# Altium project motor_contorl_board.PrjPcb
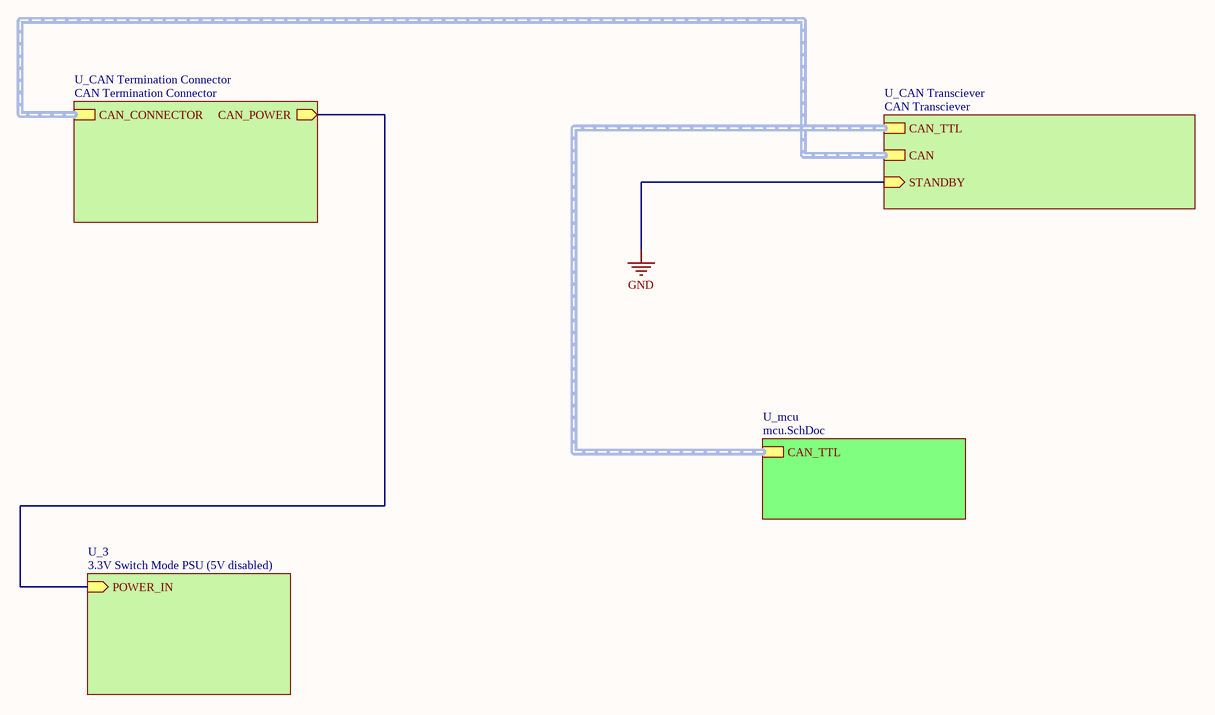
[diagram p0: toplevel.SchDoc]
3 sheets, 28 parts. Net scope: hierarchical (ports join the sheet entries above them; power ports are global).
Sheets:
  toplevel.SchDoc
    U_mcu = mcu.SchDoc
      U_pwmdisplay = pwmdisplay.SchDoc

## Sheet toplevel.SchDoc
size A4

### Sub-sheets
U_3 = 3.3V Switch Mode PSU (5V disabled) (file not in this document): POWER_IN (in)
U_CAN Termination Connector = CAN Termination Connector (file not in this document): CAN_CONNECTOR (harness CAN), CAN_POWER (out)
U_CAN Transciever = CAN Transciever (file not in this document): CAN_TTL (harness CAN_TTL), CAN (harness CAN), STANDBY (in)
U_mcu = mcu.SchDoc: CAN_TTL (harness CAN_TTL)

### Nets
(unnamed): sheet U_CAN Termination Connector/CAN_POWER, sheet U_3/POWER_IN

### Buses and harness runs
harness sheet U_CAN Termination Connector/CAN_CONNECTOR = sheet U_CAN Transciever/CAN
harness sheet U_CAN Transciever/CAN_TTL = sheet U_mcu/CAN_TTL

## Sheet mcu.SchDoc
size A4
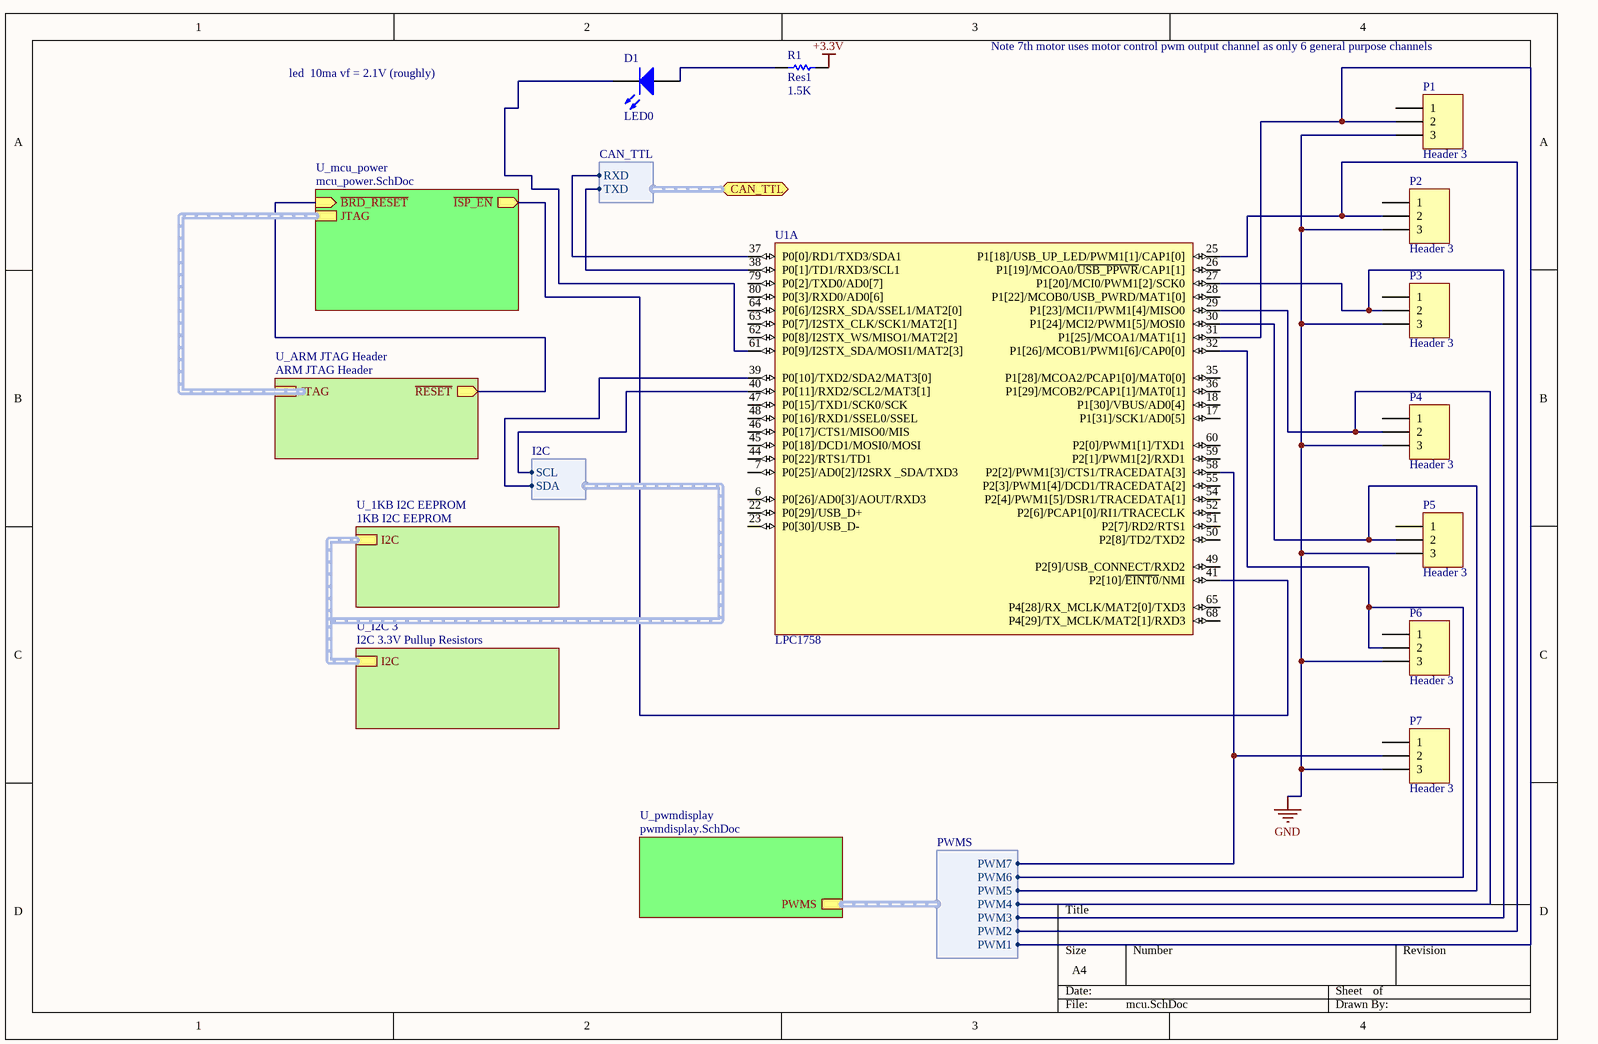
[diagram p1: mcu.SchDoc]

### Parts
D1  LED0  [LGQ971]
P1  Header 3  [HDR1X3]
P2  Header 3  [HDR1X3]
P3  Header 3  [HDR1X3]
P4  Header 3  [HDR1X3]
P5  Header 3  [HDR1X3]
P6  Header 3  [HDR1X3]
P7  Header 3  [HDR1X3]
R1  Res1  value 1.5K  [AXIAL-0.3]
U1  LPC1758  [LPC1758FBD80]  (part A of 3)

### Sub-sheets
U_1KB I2C EEPROM = 1KB I2C EEPROM (file not in this document): I2C (harness I2C)
U_ARM JTAG Header = ARM JTAG Header (file not in this document): JTAG (harness ARM_JTAG), ~{RESET} (out)
U_I2C 3 = I2C 3.3V Pullup Resistors (file not in this document): I2C (harness I2C)
U_mcu_power = mcu_power.SchDoc (file not in this document): ~{ISP_EN} (out), ~{BRD_RESET} (in), JTAG (harness ARM_JTAG)
U_pwmdisplay = pwmdisplay.SchDoc: PWMS (harness PWMS)

### Ports
CAN_TTL (harness CAN_TTL)

### Harnesses
CAN_TTL: RXD, TXD
I2C: SCL, SDA
PWMS: PWM1, PWM2, PWM3, PWM4, PWM5, PWM6, PWM7

### Nets
+3.3V: R1.2
GND: P1.3 P2.3 P3.3 P4.3 P5.3 P6.3 P7.3
Net*_2: P5.2 U1.30(P1[24]/MCI2/PWM1[5]/MOSI0) ; sheet U_pwmdisplay/PWMS.PWM5
Net*_4: P6.2 U1.32(P1[26]/MCOB1/PWM1[6]/CAP0[0]) ; sheet U_pwmdisplay/PWMS.PWM6
Net*_6: P7.2 U1.58(P2[2]/PWM1[3]/CTS1/TRACEDATA[3]) ; sheet U_pwmdisplay/PWMS.PWM7
Net*_11: P1.2 U1.31(P1[25]/MCOA1/MAT1[1]) ; sheet U_pwmdisplay/PWMS.PWM1
Net*_13: P2.2 U1.25(P1[18]/USB_UP_LED/PWM1[1]/CAP1[0]) ; sheet U_pwmdisplay/PWMS.PWM2
Net*_15: P3.2 U1.27(P1[20]/MCI0/PWM1[2]/SCK0) ; sheet U_pwmdisplay/PWMS.PWM3
Net*_17: P4.2 U1.29(P1[23]/MCI1/PWM1[4]/MISO0) ; sheet U_pwmdisplay/PWMS.PWM4
NetD1_1: D1.1(A) R1.1
NetD1_2: D1.2(K) U1.61(P0[9]/I2STX_SDA/MOSI1/MAT2[3])
NetU1_37: U1.37(P0[0]/RD1/TXD3/SDA1) ; port CAN_TTL.RXD
NetU1_38: U1.38(P0[1]/TD1/RXD3/SCL1) ; port CAN_TTL.TXD
NetU1_39: U1.39(P0[10]/TXD2/SDA2/MAT3[0]) ; sheet U_I2C 3/I2C.SDA
NetU1_40: U1.40(P0[11]/RXD2/SCL2/MAT3[1]) ; sheet U_I2C 3/I2C.SCL
NetU1_41: U1.41(P2[10]/~{EINT0}/NMI) ; sheet U_mcu_power/~{ISP_EN}
(unnamed): sheet U_mcu_power/~{BRD_RESET}, sheet U_ARM JTAG Header/~{RESET}

Not connected (* = marked no-connect by the designer): P1 1; P2 1; P3 1; P4 1; P5 1; P6 1; P7 1; U1 6(P0[26]/AD0[3]/AOUT/RXD3) 7(P0[25]/AD0[2]/I2SRX__SDA/TXD3) 17(P1[31]/SCK1/AD0[5]) 18(P1[30]/VBUS/AD0[4]) 22(P0[29]/USB_D+) 23(P0[30]/USB_D-) 26(P1[19]/MCOA0/~{USB_PPWR}/CAP1[1]) 28(P1[22]/MCOB0/USB_PWRD/MAT1[0]) 35(P1[28]/MCOA2/PCAP1[0]/MAT0[0]) 36(P1[29]/MCOB2/PCAP1[1]/MAT0[1]) 44(P0[22]/RTS1/TD1) 45(P0[18]/DCD1/MOSI0/MOSI) 46(P0[17]/CTS1/MISO0/MIS) 47(P0[15]/TXD1/SCK0/SCK) 48(P0[16]/RXD1/SSEL0/SSEL) 49(P2[9]/USB_CONNECT/RXD2) 50(P2[8]/TD2/TXD2) 51(P2[7]/RD2/RTS1) 52(P2[6]/PCAP1[0]/RI1/TRACECLK) 54(P2[4]/PWM1[5]/DSR1/TRACEDATA[1]) 55(P2[3]/PWM1[4]/DCD1/TRACEDATA[2]) 59(P2[1]/PWM1[2]/RXD1) 60(P2[0]/PWM1[1]/TXD1) 62(P0[8]/I2STX_WS/MISO1/MAT2[2]) 63(P0[7]/I2STX_CLK/SCK1/MAT2[1]) 64(P0[6]/I2SRX_SDA/SSEL1/MAT2[0]) 65(P4[28]/RX_MCLK/MAT2[0]/TXD3) 68(P4[29]/TX_MCLK/MAT2[1]/RXD3) 79(P0[2]/TXD0/AD0[7]) 80(P0[3]/RXD0/AD0[6])

### Buses and harness runs
harness sheet U_1KB I2C EEPROM/I2C = sheet U_I2C 3/I2C
harness sheet U_ARM JTAG Header/JTAG = sheet U_mcu_power/JTAG

### Notes on the sheet
- Note 7th motor uses motor control pwm output channel as only 6 general purpose channels
- led  10ma vf = 2.1V (roughly)

### Library data of the parts
D1 = LED0: Typical INFRARED GaAs LED; Published: 8-Jun-2000; LatestRevisionDate: 08-Jul-2005; LatestRevisionNote: Mech Layer 1 removed.; PackageReference: LED-0; Publisher: Altium Limited; PackageDescription: LED; 2 Leads
P1-P7 = Header 3: Header, 3-Pin; LatestRevisionDate: 17-Jul-2002; LatestRevisionNote: Re-released for DXP Platform.; Publisher: Altium Limited
R1 = Res1: Resistor; Published: 8-Jun-2000; LatestRevisionDate: 17-Jul-2002; LatestRevisionNote: Re-released for DXP Platform.; PackageReference: AXIAL-0.3; Publisher: Altium Limited; PackageDescription: Axial Device, Thru-Hole; 2 Leads; 0.3 in Pin Spacing
U1 = LPC1758: NXP - LPC1758FBD80 - MCU, 32BIT, ARM CORTEX M3, 80LQFP; farnell: 1718545

## Sheet pwmdisplay.SchDoc
size A4
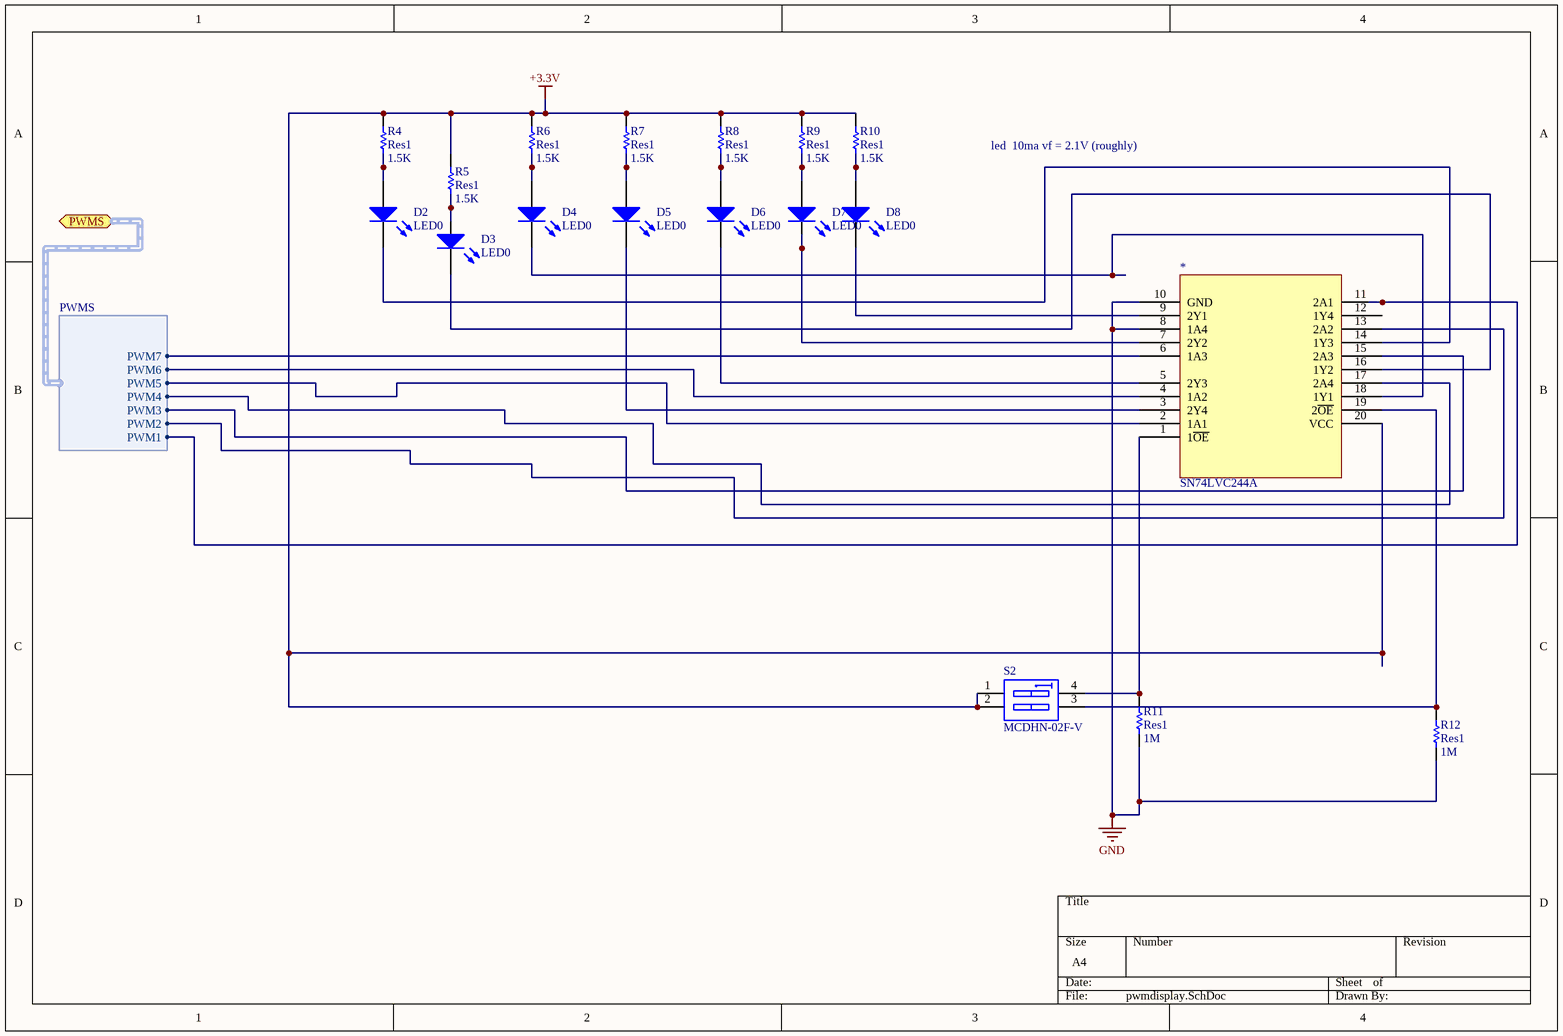
[diagram p2: pwmdisplay.SchDoc]

### Parts
*  SN74LVC244A  [DW (R-PDS0-G20)]
D2  LED0  [LGQ971]
D3  LED0  [LGQ971]
D4  LED0  [LGQ971]
D5  LED0  [LGQ971]
D6  LED0  [LGQ971]
D7  LED0  [LGQ971]
D8  LED0  [LGQ971]
R4  Res1  value 1.5K  [AXIAL-0.3]
R5  Res1  value 1.5K  [AXIAL-0.3]
R6  Res1  value 1.5K  [AXIAL-0.3]
R7  Res1  value 1.5K  [AXIAL-0.3]
R8  Res1  value 1.5K  [AXIAL-0.3]
R9  Res1  value 1.5K  [AXIAL-0.3]
R10  Res1  value 1.5K  [AXIAL-0.3]
R11  Res1  value 1M  [AXIAL-0.3]
R12  Res1  value 1M  [AXIAL-0.3]
S2  MCDHN-02F-V  [MCDHN-02F-V]

### Ports
PWMS (harness PWMS)

### Harnesses
PWMS: PWM1, PWM2, PWM3, PWM4, PWM5, PWM6, PWM7

### Nets
+3.3V: *.20(VCC) R4.2 R5.2 R6.2 R7.2 R8.2 R9.2 R10.2 S2.1(A1) S2.2(A2)
GND: *.8(1A4) *.10(GND) R11.1 R12.1
Net*_1: *.1(1~{OE}) R11.2 S2.4(B1)
Net*_2: *.2(1A1) ; port PWMS.PWM5
Net*_3: *.3(2Y4) D5.2(K)
Net*_4: *.4(1A2) ; port PWMS.PWM6
Net*_5: *.5(2Y3) D6.2(K)
Net*_6: *.6(1A3) ; port PWMS.PWM7
Net*_7: *.7(2Y2) D7.2(K)
Net*_9: *.9(2Y1) D8.2(K)
Net*_11: *.11(2A1) ; port PWMS.PWM1
Net*_13: *.13(2A2) ; port PWMS.PWM2
Net*_14: *.14(1Y3) D2.2(K)
Net*_15: *.15(2A3) ; port PWMS.PWM3
Net*_16: *.16(1Y2) D3.2(K)
Net*_17: *.17(2A4) ; port PWMS.PWM4
Net*_18: *.18(1Y1) D4.2(K)
Net*_19: *.19(2~{OE}) R12.2 S2.3(B2)
NetD2_1: D2.1(A) R4.1
NetD3_1: D3.1(A) R5.1
NetD4_1: D4.1(A) R6.1
NetD5_1: D5.1(A) R7.1
NetD6_1: D6.1(A) R8.1
NetD7_1: D7.1(A) R9.1
NetD8_1: D8.1(A) R10.1

Not connected (* = marked no-connect by the designer): * 12(1Y4)

### Notes on the sheet
- led  10ma vf = 2.1V (roughly)

### Library data of the parts
D2-D8 = LED0: Typical INFRARED GaAs LED; Published: 8-Jun-2000; LatestRevisionDate: 08-Jul-2005; LatestRevisionNote: Mech Layer 1 removed.; PackageReference: LED-0; Publisher: Altium Limited; PackageDescription: LED; 2 Leads
R4-R12 = Res1: Resistor; Published: 8-Jun-2000; LatestRevisionDate: 17-Jul-2002; LatestRevisionNote: Re-released for DXP Platform.; PackageReference: AXIAL-0.3; Publisher: Altium Limited; PackageDescription: Axial Device, Thru-Hole; 2 Leads; 0.3 in Pin Spacing
S2 = SW DIP-2: DIP Switch, 2 Position, SPST; Published: 24-Mar-1999; LatestRevisionDate: 17-Jul-2002; LatestRevisionNote: Re-released for DXP Platform.; PackageReference: DIP-4; Publisher: Altium Limited

## Nets that join several sheets
+3.3V: mcu (R1.2), pwmdisplay (10 pins)
GND: mcu (7 pins), pwmdisplay (*.8 *.10 R11.1 R12.1)
Net*_2: mcu (P5.2 U1.30), pwmdisplay (*.2)
Net*_4: mcu (P6.2 U1.32), pwmdisplay (*.4)
Net*_6: mcu (P7.2 U1.58), pwmdisplay (*.6)
Net*_11: mcu (P1.2 U1.31), pwmdisplay (*.11)
Net*_13: mcu (P2.2 U1.25), pwmdisplay (*.13)
Net*_15: mcu (P3.2 U1.27), pwmdisplay (*.15)
Net*_17: mcu (P4.2 U1.29), pwmdisplay (*.17)